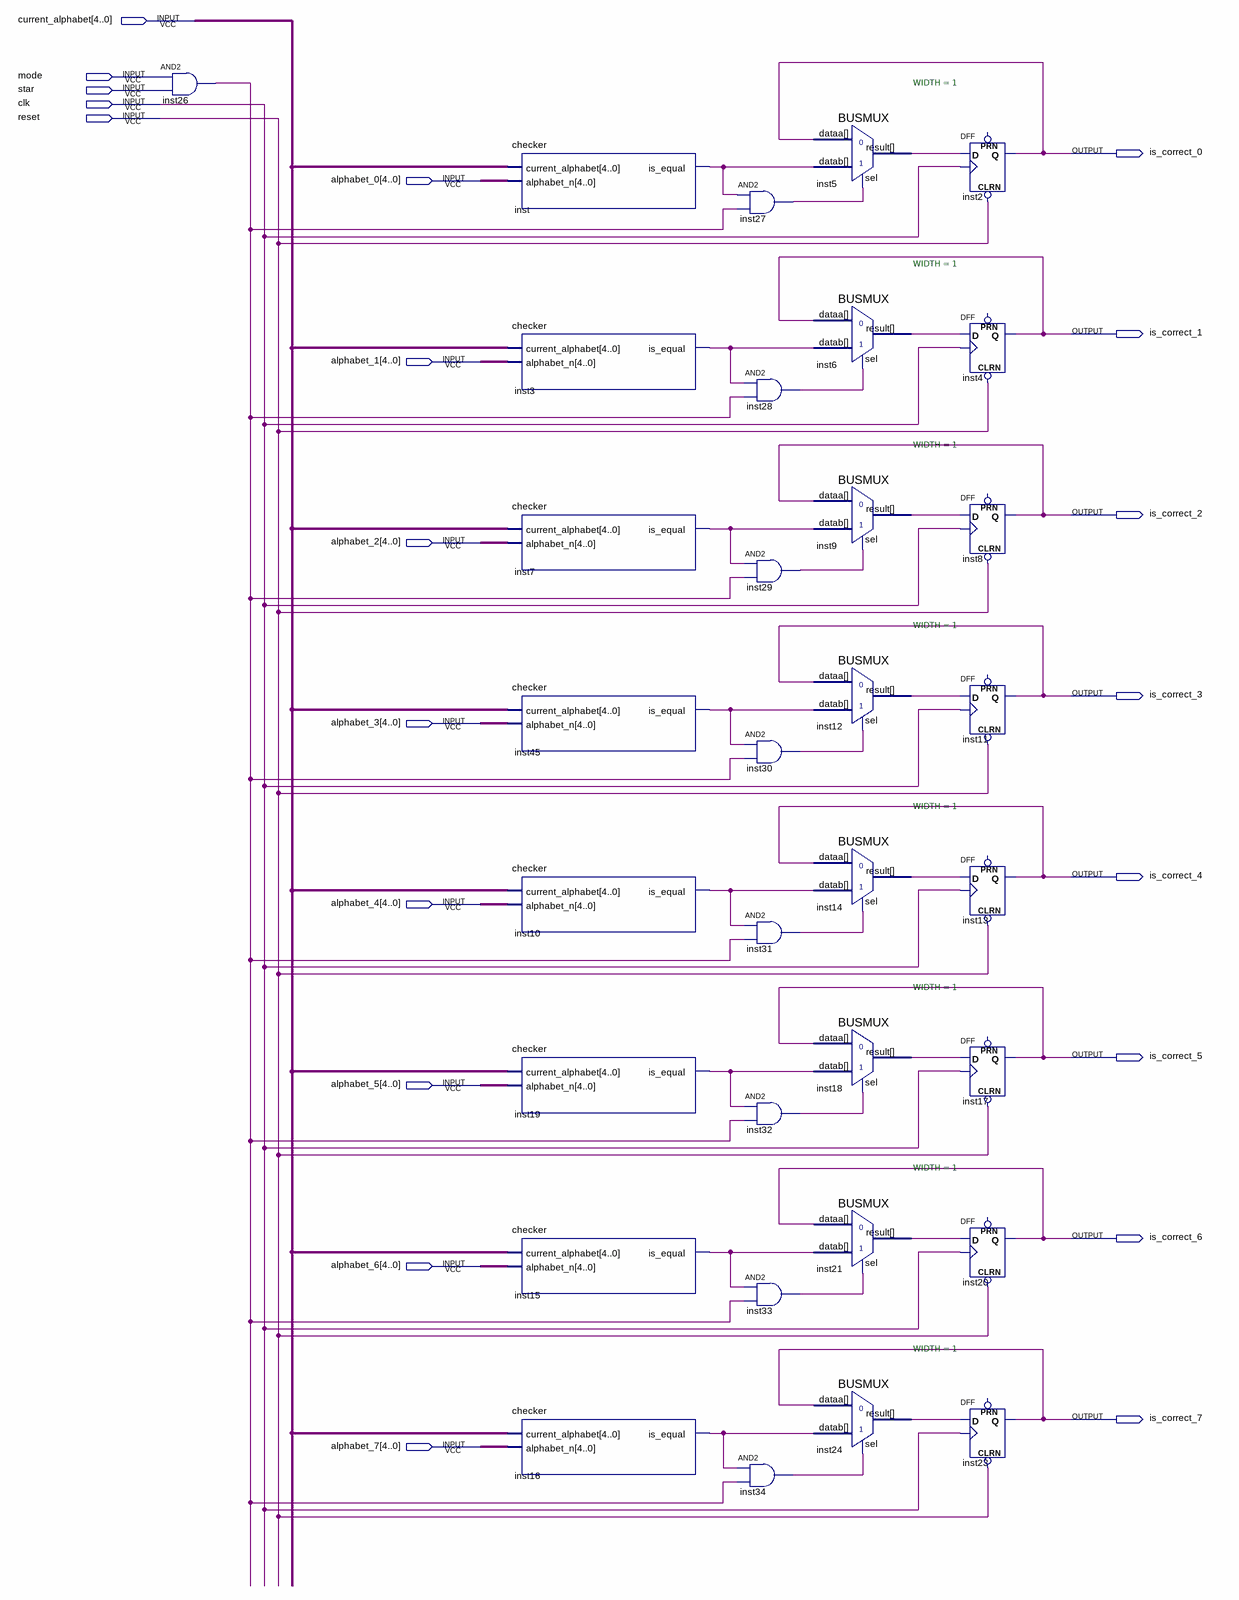
[diagram p0: schematic sheet]
// Quartus schematic is_correct.bdf as structural Verilog: 33 symbols, 21 pins
module is_correct (
  input  [4:0] current_alphabet,
  input  mode,
  input  star,
  input  clk,
  input  reset,
  input  [4:0] alphabet_0,
  input  [4:0] alphabet_1,
  input  [4:0] alphabet_2,
  input  [4:0] alphabet_3,
  input  [4:0] alphabet_4,
  input  [4:0] alphabet_5,
  input  [4:0] alphabet_6,
  input  [4:0] alphabet_7,
  output is_correct_0,
  output is_correct_1,
  output is_correct_2,
  output is_correct_3,
  output is_correct_4,
  output is_correct_5,
  output is_correct_6,
  output is_correct_7
);

  wire inst3_is_equal, inst5_result, inst6_result, inst7_is_equal, inst9_result, inst10_is_equal,
       inst12_result, inst14_result, inst15_is_equal, inst16_is_equal, inst18_result, inst19_is_equal,
       inst21_result, inst24_result, inst26_out, inst27_out, inst28_out, inst29_out, inst30_out, inst31_out,
       inst32_out, inst33_out, inst34_out, inst45_is_equal, inst_is_equal;

  and inst26 (inst26_out, mode, star);
  \checker  inst (.current_alphabet(current_alphabet), .alphabet_n(alphabet_0), .is_equal(inst_is_equal));
  \checker  inst3 (.current_alphabet(current_alphabet), .alphabet_n(alphabet_1), .is_equal(inst3_is_equal));
  \checker  inst7 (.current_alphabet(current_alphabet), .alphabet_n(alphabet_2), .is_equal(inst7_is_equal));
  \checker  inst45 (.current_alphabet(current_alphabet), .alphabet_n(alphabet_3), .is_equal(inst45_is_equal));
  \checker  inst10 (.current_alphabet(current_alphabet), .alphabet_n(alphabet_4), .is_equal(inst10_is_equal));
  \checker  inst19 (.current_alphabet(current_alphabet), .alphabet_n(alphabet_5), .is_equal(inst19_is_equal));
  \checker  inst15 (.current_alphabet(current_alphabet), .alphabet_n(alphabet_6), .is_equal(inst15_is_equal));
  \checker  inst16 (.current_alphabet(current_alphabet), .alphabet_n(alphabet_7), .is_equal(inst16_is_equal));
  and inst27 (inst27_out, inst_is_equal, inst26_out);
  and inst28 (inst28_out, inst3_is_equal, inst26_out);
  and inst29 (inst29_out, inst7_is_equal, inst26_out);
  and inst30 (inst30_out, inst45_is_equal, inst26_out);
  and inst31 (inst31_out, inst10_is_equal, inst26_out);
  and inst32 (inst32_out, inst19_is_equal, inst26_out);
  and inst33 (inst33_out, inst15_is_equal, inst26_out);
  and inst34 (inst34_out, inst16_is_equal, inst26_out);
  BUSMUX #(.WIDTH(1)) inst5 (.datab(inst_is_equal), .sel(inst27_out), .dataa(is_correct_0), .result(inst5_result));
  BUSMUX #(.WIDTH(1)) inst6 (.datab(inst3_is_equal), .sel(inst28_out), .dataa(is_correct_1), .result(inst6_result));
  BUSMUX #(.WIDTH(1)) inst9 (.datab(inst7_is_equal), .sel(inst29_out), .dataa(is_correct_2), .result(inst9_result));
  BUSMUX #(.WIDTH(1)) inst12 (.datab(inst45_is_equal), .sel(inst30_out), .dataa(is_correct_3), .result(inst12_result));
  BUSMUX #(.WIDTH(1)) inst14 (.datab(inst10_is_equal), .sel(inst31_out), .dataa(is_correct_4), .result(inst14_result));
  BUSMUX #(.WIDTH(1)) inst18 (.datab(inst19_is_equal), .sel(inst32_out), .dataa(is_correct_5), .result(inst18_result));
  BUSMUX #(.WIDTH(1)) inst21 (.datab(inst15_is_equal), .sel(inst33_out), .dataa(is_correct_6), .result(inst21_result));
  BUSMUX #(.WIDTH(1)) inst24 (.datab(inst16_is_equal), .sel(inst34_out), .dataa(is_correct_7), .result(inst24_result));
  DFF inst2 (.CLRN(reset), .CLK(clk), .D(inst5_result), .Q(is_correct_0));  // open: PRN
  DFF inst4 (.CLRN(reset), .CLK(clk), .D(inst6_result), .Q(is_correct_1));  // open: PRN
  DFF inst8 (.CLRN(reset), .CLK(clk), .D(inst9_result), .Q(is_correct_2));  // open: PRN
  DFF inst11 (.CLRN(reset), .CLK(clk), .D(inst12_result), .Q(is_correct_3));  // open: PRN
  DFF inst13 (.CLRN(reset), .CLK(clk), .D(inst14_result), .Q(is_correct_4));  // open: PRN
  DFF inst17 (.CLRN(reset), .CLK(clk), .D(inst18_result), .Q(is_correct_5));  // open: PRN
  DFF inst20 (.CLRN(reset), .CLK(clk), .D(inst21_result), .Q(is_correct_6));  // open: PRN
  DFF inst23 (.CLRN(reset), .CLK(clk), .D(inst24_result), .Q(is_correct_7));  // open: PRN
endmodule
